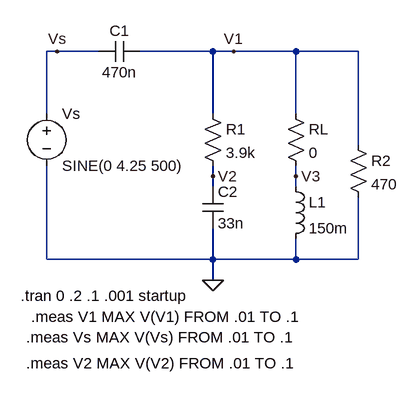
[diagram p0: schematic lab4.asc]
lab4.asc, the LTspice schematic file:
Version 4.1
SHEET 1 880 680
WIRE 96 32 80 32
WIRE 160 32 96 32
WIRE 336 32 224 32
WIRE 368 32 336 32
WIRE 464 32 368 32
WIRE 560 32 464 32
WIRE 80 128 80 32
WIRE 336 128 336 32
WIRE 464 128 464 32
WIRE 560 176 560 32
WIRE 336 224 336 208
WIRE 464 224 464 208
WIRE 336 240 336 224
WIRE 464 240 464 224
WIRE 80 352 80 208
WIRE 336 352 336 304
WIRE 336 352 80 352
WIRE 464 352 464 320
WIRE 464 352 336 352
WIRE 560 352 560 256
WIRE 560 352 464 352
WIRE 336 384 336 352
FLAG 336 384 0
FLAG 368 32 V1
FLAG 96 32 Vs
FLAG 336 224 V2
FLAG 464 224 V3
SYMBOL voltage 80 112 R0
WINDOW 123 0 0 Left 0
WINDOW 39 0 0 Left 0
SYMATTR InstName Vs
SYMATTR Value SINE(0 4.25 500)
SYMBOL cap 224 16 R90
WINDOW 0 0 32 VBottom 2
WINDOW 3 32 32 VTop 2
SYMATTR InstName C1
SYMATTR Value 470n
SYMBOL res 320 112 R0
SYMATTR InstName R1
SYMATTR Value 3.9k
SYMBOL res 544 160 R0
SYMATTR InstName R2
SYMATTR Value 470
SYMBOL res 448 112 R0
SYMATTR InstName RL
SYMATTR Value 0
SYMBOL cap 320 240 R0
SYMATTR InstName C2
SYMATTR Value 33n
SYMBOL ind 448 224 R0
SYMATTR InstName L1
SYMATTR Value 150m
TEXT 40 408 Left 2 !.tran 0 .2 .1 .001 startup
TEXT 48 512 Left 2 !.meas V2 MAX V(V2) FROM .01 TO .1
TEXT 48 472 Left 2 !.meas Vs MAX V(Vs) FROM .01 TO .1
TEXT 56 440 Left 2 !.meas V1 MAX V(V1) FROM .01 TO .1

The netlist it stands for:
* lab4.asc
Vs Vs 0 SINE(0 4.25 500)
C1 V1 Vs 470n
R1 V1 V2 3.9k
R2 V1 0 470
RL V1 V3 0
C2 V2 0 33n
L1 V3 0 150m
.tran 0 .2 .1 .001 startup
.meas V2 MAX V(V2) FROM .01 TO .1
.meas Vs MAX V(Vs) FROM .01 TO .1
.meas V1 MAX V(V1) FROM .01 TO .1
.backanno
.end